# EAGLE design mySensorsRS485GW_front (EAGLE 8.1.1)
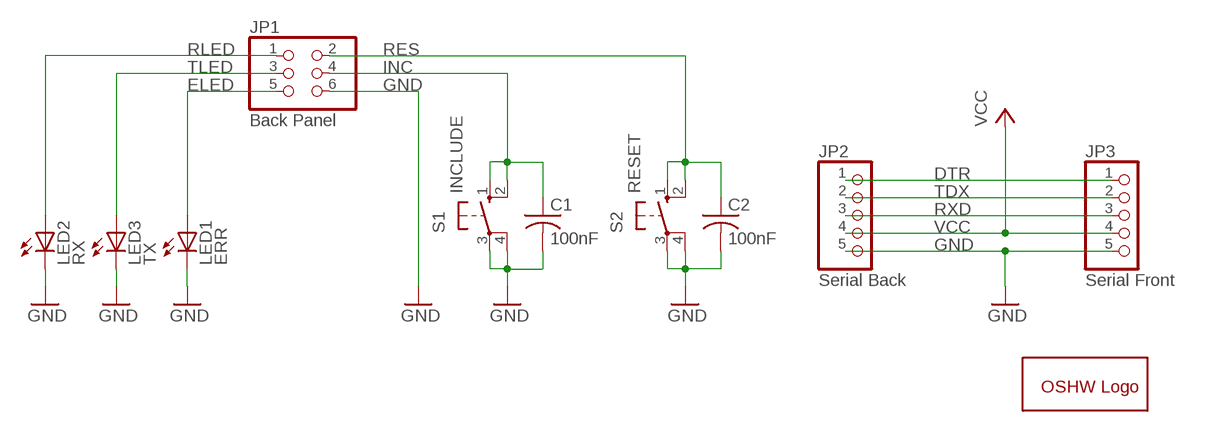
[diagram p0: schematic, sheet 1]

## Parts
C1  100nF  C-US025-025X050  [C025-025X050]
C2  100nF  C-US025-025X050  [C025-025X050]
GOLD_ORB_SM1  OSHWLOGOLOGO5MM  [OSHW_5MM]
JP1  Back Panel  PINHD-2X3  [2X03]
JP2  Serial Back  PINHD-1X5  [1X05]
JP3  Serial Front  PINHD-1X5  [1X05]
LED1  ERR  LED3MM  [LED3MM]
LED2  RX  LED3MM  [LED3MM]
LED3  TX  LED3MM  [LED3MM]
S1  INCLUDE  10-XX  [B3F-10XX]
S2  RESET  10-XX  [B3F-10XX]

## Nets
DTR: JP2.1 JP3.1
ELED: JP1.5 LED1.A
GND: C1.2 C2.2 JP1.6 JP2.5 JP3.5 LED1.K(C) LED2.K(C) LED3.K(C) S1.3(P) S1.4(P1) S2.3(P) S2.4(P1)
INC: C1.1 JP1.4 S1.1(S) S1.2(S1)
RES: C2.1 JP1.2 S2.1(S) S2.2(S1)
RLED: JP1.1 LED2.A
RXD: JP2.3 JP3.3
TDX: JP2.2 JP3.2
TLED: JP1.3 LED3.A
VCC: JP2.4 JP3.4

## Library data of the parts
C1 C2 = adafruit:C-US: CAPACITOR, American symbol
GOLD_ORB_SM1 = oshw:OSHWLOGO: The OSHW logo for PCB layout
JP1 = pinhead:PINHD-2X3: PIN HEADER
JP2 JP3 = pinhead:PINHD-1X5: PIN HEADER
LED1-LED3 = led:LED: LED OSRAM: - CHIPLED LG R971, LG N971, LY N971, LG Q971, LY Q971, LO R971, LY R971 LH N974, LH R974 LS Q976, LO Q976, LY Q976 LO Q996 - Hyper CHIPLED LW Q18S LB Q993, LB Q99A, LB R99A - SideLED LS A670, LO A670, LY A670, LG A670, LP A670 LB A673, LV A673, LT A673, LW A673 LH A674 LY A675 LS A676, LA A676, LO A676, LY A676, LW A676 LS A679, LY A679, LG A679 - Hyper Micro SIDELED® LS Y876, LA Y876, LO Y876, LY Y876 LT Y87S - SmartLED LW L88C, LW L88S LB L89C, LB L89S, LG L890 LS L89K, LO L89K, LY L89K LS L896, LA L896, LO L896, LY L896 - TOPLED LS T670, LO T670, LY T670, LG T670, LP T670 LSG T670, LSP T670, LSY T670, LOP T670, LYG T670 LG T671, LOG T671, LSG T671 LB T673, LV T673, LT T673, LW T673 LH T674 LS T676, LA T676, LO T676, LY T676, LB T676, LH T676, LSB T676, LW T676 LB T67C, LV T67C, LT T67C, LS T67K, LO T67K, LY T67K, LW E67C LS E67B, LA E67B, LO E67B, LY E67B, LB E67C, LV E67C, LT E67C LW T67C LS T679, LY T679, LG T679 LS T770, LO T770, LY T770, LG T770, LP T770 LB T773, LV T773, LT T773, LW T773 LH T774 LS E675, LA E675, LY E675, LS T675 LS T776, LA T776, LO T776, LY T776, LB T776 LHGB T686 LT T68C, LB T68C - Hyper Mini TOPLED® LB M676 - Mini TOPLED Santana® LG M470 LS M47K, LO M47K, LY M47K Source: http://www.osram.convergy.de LUXEON: - LUMILED® LXK2-PW12-R00, LXK2-PW12-S00, LXK2-PW14-U00, LXK2-PW14-V00 LXK2-PM12-R00, LXK2-PM12-S00, LXK2-PM14-U00 LXK2-PE12-Q00, LXK2-PE12-R00, LXK2-PE12-S00, LXK2-PE14-T00, LXK2-PE14-U00 LXK2-PB12-K00, LXK2-PB12-L00, LXK2-PB12-M00, LXK2-PB14-N00, LXK2-PB14-P00, LXK2-PB14-Q00 LXK2-PR12-L00, LXK2-PR12-M00, LXK2-PR14-Q00, LXK2-PR14-R00 LXK2-PD12-Q00, LXK2-PD12-R00, LXK2-PD12-S00 LXK2-PH12-R00, LXK2-PH12-S00 LXK2-PL12-P00, LXK2-PL12-Q00, LXK2-PL12-R00 Source: www.luxeon.com KINGBRIGHT: KA-3528ASYC Source: www.kingbright.com
S1 S2 = switch-omron:10-XX: OMRON SWITCH; MPN: B3F-1000; OC_FARNELL: 176432; OC_NEWARK: 36M3542

## Board
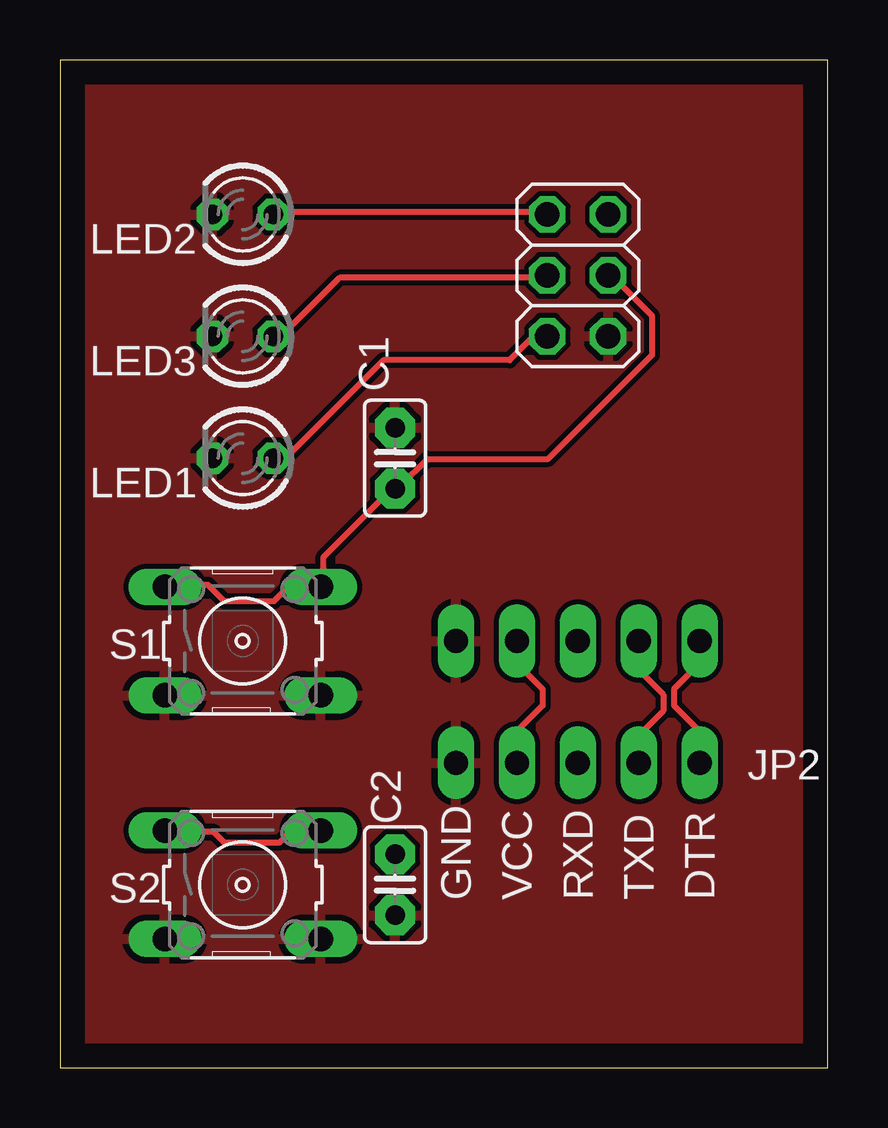
[diagram p1: board, top side]
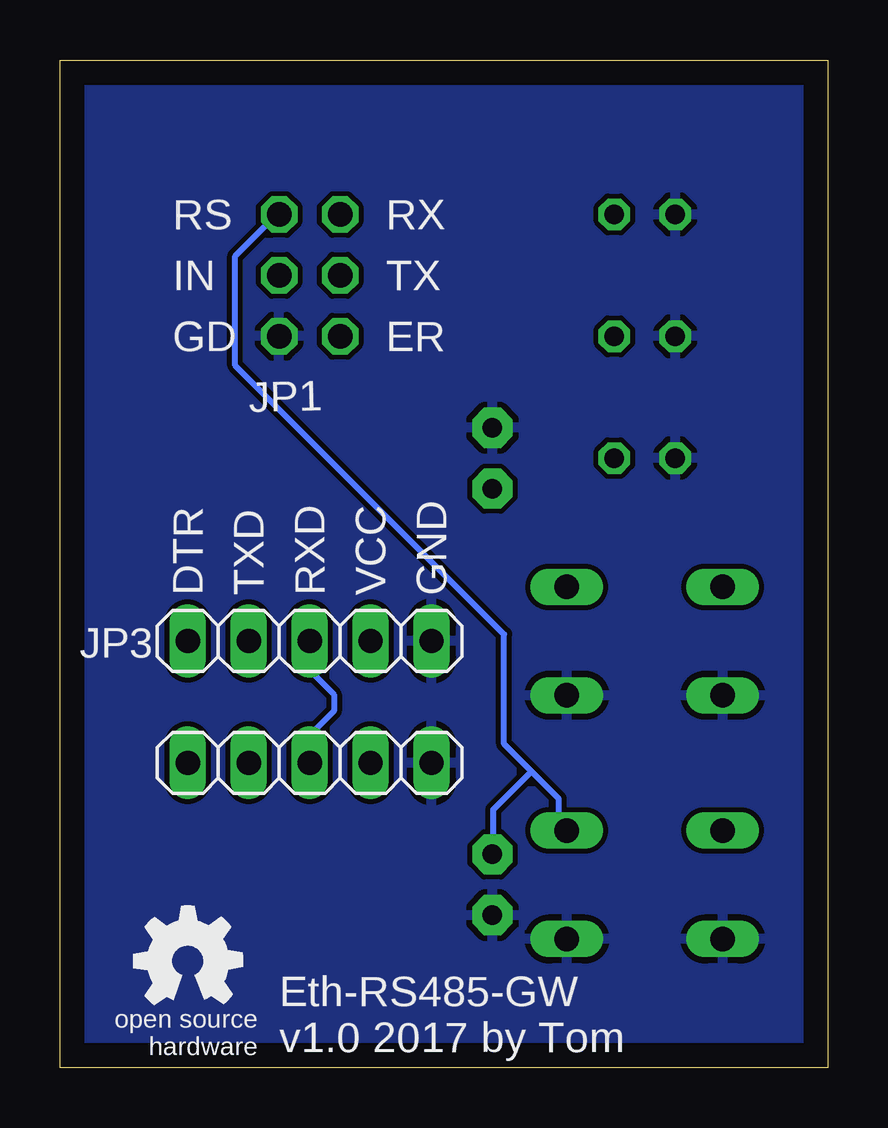
[diagram p2: board, bottom side, seen from below]

Size 32 x 42 mm. Coordinates in mm from the lower left corner, seen from the top.
Outline: 0,0 32,0 32,42 0,42 0,0
Copper layers (1*16): Top 0.035mm / dielectric 1.5mm / Bottom 0.035mm
Design rules "default": minimum track width 10mil, minimum drill 24mil, track to track 8mil, track to pad 8mil, pad to pad 8mil, via to via 8mil, smd to smd 8mil, copper to edge 40mil, drill to drill 8mil, minimum pad ring 10mil, minimum via ring 8mil, stop-mask expansion 4mil, vias tented up to drill 0mil, thermal gap 10mil

### Footprints (pad centres in the part's own frame; a part is rotated, then mirrored left to right if it is on the bottom)
C025-025X050 = drill 0.813 pad 1.676 octagon: 1 -1.27,0; 2 1.27,0
2X03 = drill 1.016 octagon: 1 -2.54,-1.27; 2 -2.54,1.27; 3 0,-1.27; 4 0,1.27; 5 2.54,-1.27; 6 2.54,1.27
1X05 = drill 1.016 long: 1 -5.08,0; 2 -2.54,0; 3 0,0; 4 2.54,0; 5 5.08,0
LED3MM = drill 0.813 octagon: A -1.27,0; K 1.27,0
B3F-10XX = drill 1.016 long: 1 -3.251,2.261; 2 3.251,2.261; 3 -3.251,-2.261; 4 3.251,-2.261

### Placement (x,y rotation side)
C1  13.97,25.4 90 top
C2  13.97,7.62 270 top
GOLD_ORB_SM1  26.67,4.45 0 bottom
JP1  21.59,33.02 270 top
JP2  21.59,12.7 0 bottom
JP3  21.59,17.78 0 bottom
LED1  7.62,25.4 180 top
LED2  7.62,35.56 180 top
LED3  7.62,30.48 180 top
S1  7.62,17.78 0 top
S2  7.62,7.62 0 top

### Tracks (layer width: path | path; a pad name or v marks a point on that pad's centre or on a via)
DTR
  Top 0.254: JP2.1 26.52,12.8 26.52,14.17 25.6,15.09 25.6,15.77 26.52,16.69 26.52,17.6 JP3.1
ELED
  Top 0.254: LED1.A 8.91,25.6 9.6,25.6 13.49,29.49 18.75,29.49 19.66,30.4 20.12,30.4 JP1.5
GND
  pour Bottom: -1.27,43.18 33.02,43.18 33.02,-1.27 -1.27,-1.27
  pour Top: -1.27,43.18 33.02,43.18 33.02,-1.27 -1.27,-1.27
INC
  Top 0.254: S1.1 4.57,20.12 6.17,20.12 6.86,19.43 8.91,19.43 9.37,19.89 10.74,19.89 S1.2 10.97,20.12 10.97,21.26 13.95,24.23 C1.1 14.17,24.23 15.32,25.38 20.34,25.38 24.69,29.72 24.69,31.32 23.09,32.92 22.86,32.92 JP1.4
RES
  Top 0.254: S2.1 4.57,9.83 6.4,9.83 6.86,9.37 9.14,9.37 9.6,9.83 10.74,9.83 S2.2
  Bottom 0.254: 12.34,12.34 11.2,11.2 11.2,10.29 10.97,10.06 S2.2 | 12.34,12.34 13.49,13.49 13.49,18.06 24.69,29.26 24.69,33.83 23.09,35.43 22.86,35.43 JP1.2 | 12.34,12.34 13.95,10.74 13.95,8.91 C2.1
RLED
  Top 0.254: LED2.A 8.91,35.66 20.12,35.66 JP1.1
RXD
  Bottom 0.254: JP2.3 21.49,12.8 21.49,13.95 20.57,14.86 20.57,15.54 21.49,16.46 21.49,17.6 JP3.3
TDX
  Top 0.254: JP2.2 24.23,12.8 24.23,13.95 25.15,14.86 25.15,15.54 24.23,16.46 24.23,17.6 JP3.2
TLED
  Top 0.254: LED3.A 8.91,30.63 9.37,30.63 11.66,32.92 20.12,32.92 JP1.3
VCC
  Top 0.254: JP2.4 19.2,12.8 19.2,14.17 20.12,15.09 20.12,15.77 19.2,16.69 19.2,17.6 JP3.4

### Text on the board
tPlace: GND | VCC | RXD | TXD | DTR
bPlace: RX | RS | TX | IN | ER | GD | GND | VCC | RXD | TXD | DTR | Eth-RS485-GW / v1.0 2017 by Tom